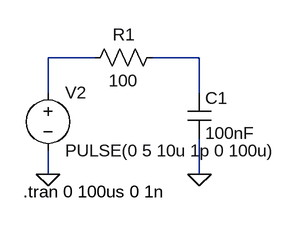
[diagram p0: schematic 01_RC_carga.asc]
01_RC_carga.asc, the LTspice schematic file:
Version 4
SHEET 1 880 680
WIRE 112 96 48 96
WIRE 256 96 192 96
WIRE 48 144 48 96
WIRE 256 144 256 96
WIRE 48 256 48 224
WIRE 256 256 256 208
FLAG 48 256 0
FLAG 256 256 0
SYMBOL cap 240 144 R0
SYMATTR InstName C1
SYMATTR Value 100nF
SYMBOL voltage 48 128 R0
WINDOW 123 0 0 Left 0
WINDOW 39 0 0 Left 0
SYMATTR InstName V2
SYMATTR Value PULSE(0 5 10u 1p 0 100u)
SYMBOL res 208 80 R90
WINDOW 0 0 56 VBottom 2
WINDOW 3 32 56 VTop 2
SYMATTR InstName R1
SYMATTR Value 100
TEXT 14 280 Left 2 !.tran 0 100us 0 1n

The netlist it stands for:
* 01_RC_carga.asc
C1 N002 0 100nF
V2 N001 0 PULSE(0 5 10u 1p 0 100u)
R1 N002 N001 100
.tran 0 100us 0 1n
.backanno
.end